# Altium schematic sheet Regulator3V3.SchDoc: Regulator 3V3
size A4; CompanyName: PRO PCB; DrawnBy: Alireza Aghasi; DocumentNumber: 1; Revision: 1; SheetNumber: 1; SheetTotal: 1; ImagePath: D:\Pro PCB\Step 6 - Source Files\Document\Picture\logo.png; Application_BuildNumber: 1
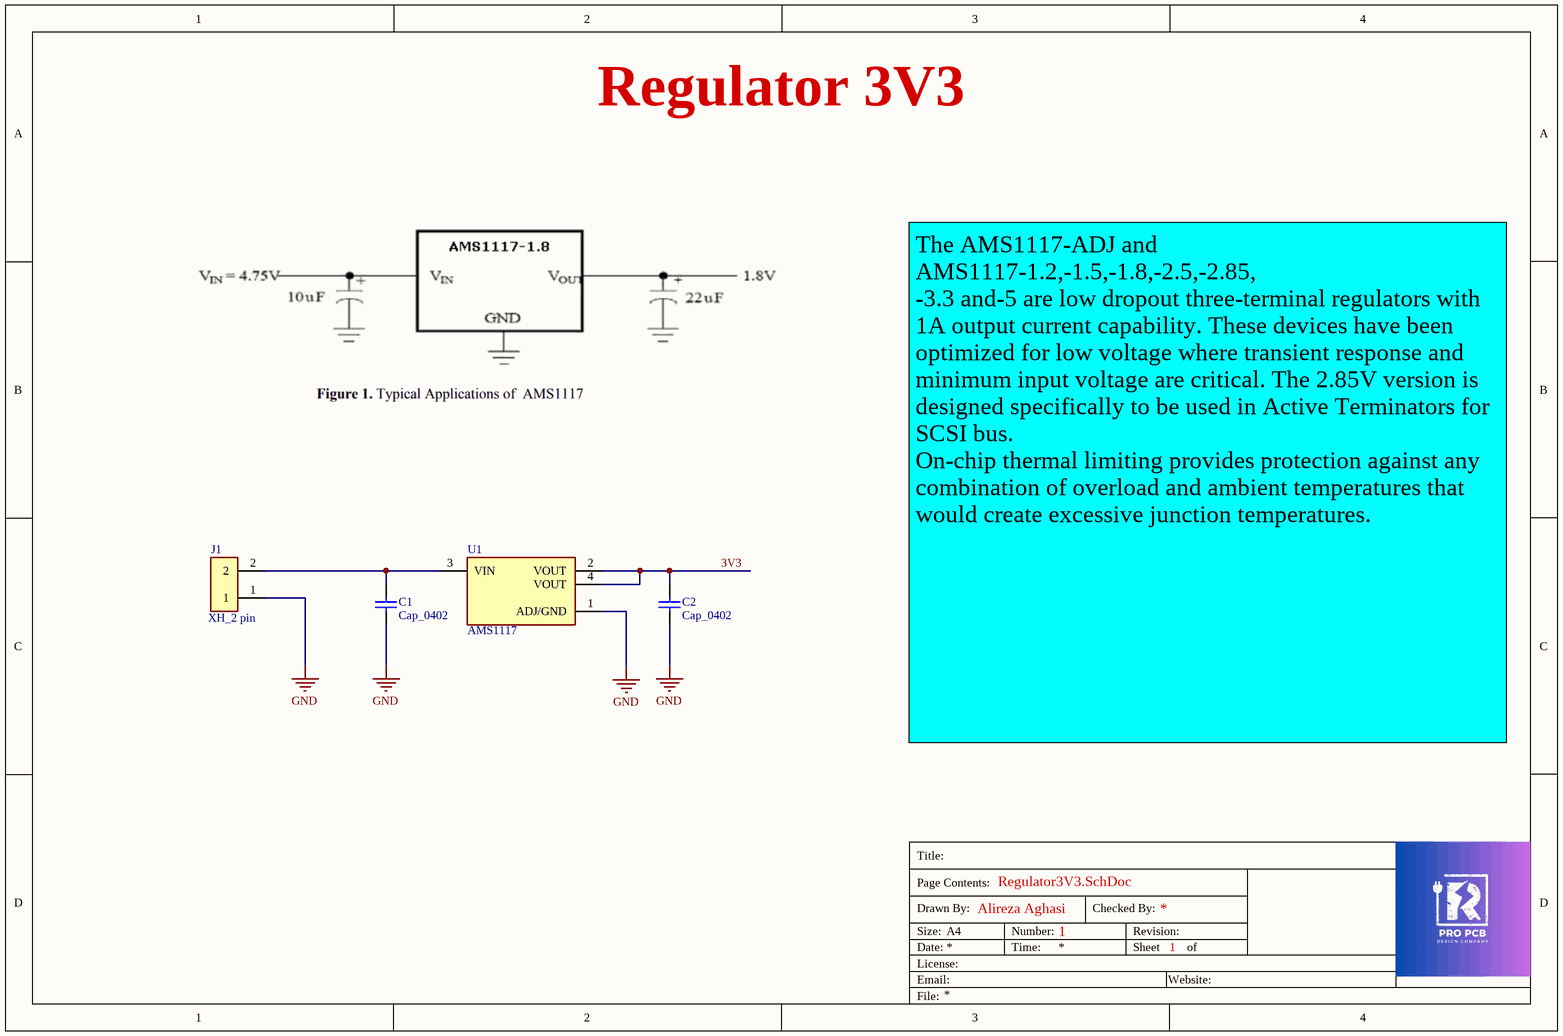
[diagram p0: Regulator3V3.SchDoc]

## Parts
C1  Cap_0402  [Capacitor_0603]
C2  Cap_0402  [Capacitor_0603]
J1  XH_2 pin  [JST_S2B-XH-A(LF)(SN)]
U1  AMS1117  [SOT229P700X180-4N]

## Nets
GND: C1.1 C2.1 J1.1 U1.1(ADJ/GND)
3V3: C2.2 U1.2(VOUT) U1.4(VOUT)
NetC1_2: C1.2 J1.2 U1.3(VIN)

## Notes on the sheet
- The AMS1117-ADJ and AMS1117-1.2,-1.5,-1.8,-2.5,-2.85,
  -3.3 and-5 are low dropout three-terminal regulators with
  1A output current capability. These devices have been
  optimized for low voltage where transient response and
  minimum input voltage are critical. The 2.85V version is
  designed specifically to be used in Active Terminators for
  SCSI bus.
  On-chip thermal limiting provides protection against any
  combination of overload and ambient temperatures that
  would create excessive junction temperatures.
- Title:
- Drawn By:
- Page Contents:
- Checked By:
- Size:
- Date:
- File:
- License:
- Email:
- A4
- Number:
- Time:
- Revision:
- Sheet
- Website:
- of

## Library data of the parts
C1 C2 = Cap_0402: 0402; Published: 8-Jun-2000; LatestRevisionDate: 17-Jul-2002; LatestRevisionNote: Re-released for DXP Platform.; PackageReference: RAD-0.3; Publisher: Altium Limited; PackageDescription: Radial Cap, Thru-Hole; 2 Leads; 0.3 in Pin Spacing
J1 = PHOENIX_2 pin: 2 Position Wire to Board Terminal Block Horizontal with Board 0.197 (5.00mm) Through Hole; MF: Phoenix Contact; MP: 1935161; Purchase-URL: https://pricing.snapeda.com/search/part/1935161/?ref=eda; Package: None; Availability: In Stock; Value: *; Check_prices: https://www.snapeda.com/parts/1935161/Phoenix+Contact/view-part/?ref=eda; SnapEDA_Link: https://www.snapeda.com/parts/1935161/Phoenix+Contact/view-part/?ref=snap; Price: None
U1 = AMS1117: 1A LOW DROPOUT VOLTAGE REGULATOR SOT-223; MF: Advanced Monolithic Systems; Price: None; Availability: Not in stock; Package: SOT-223 Seeed Technology; MP: AMS1117; Value: *; SnapEDA_Link: https://www.snapeda.com/parts/AMS1117/Advanced+Monolithic+Systems/view-part/?ref=snap; Check_prices: https://www.snapeda.com/parts/AMS1117/Advanced+Monolithic+Systems/view-part/?ref=eda